# EasyEDA Pro project 医用手套驱动板.epro

# Board 医用手套驱动板
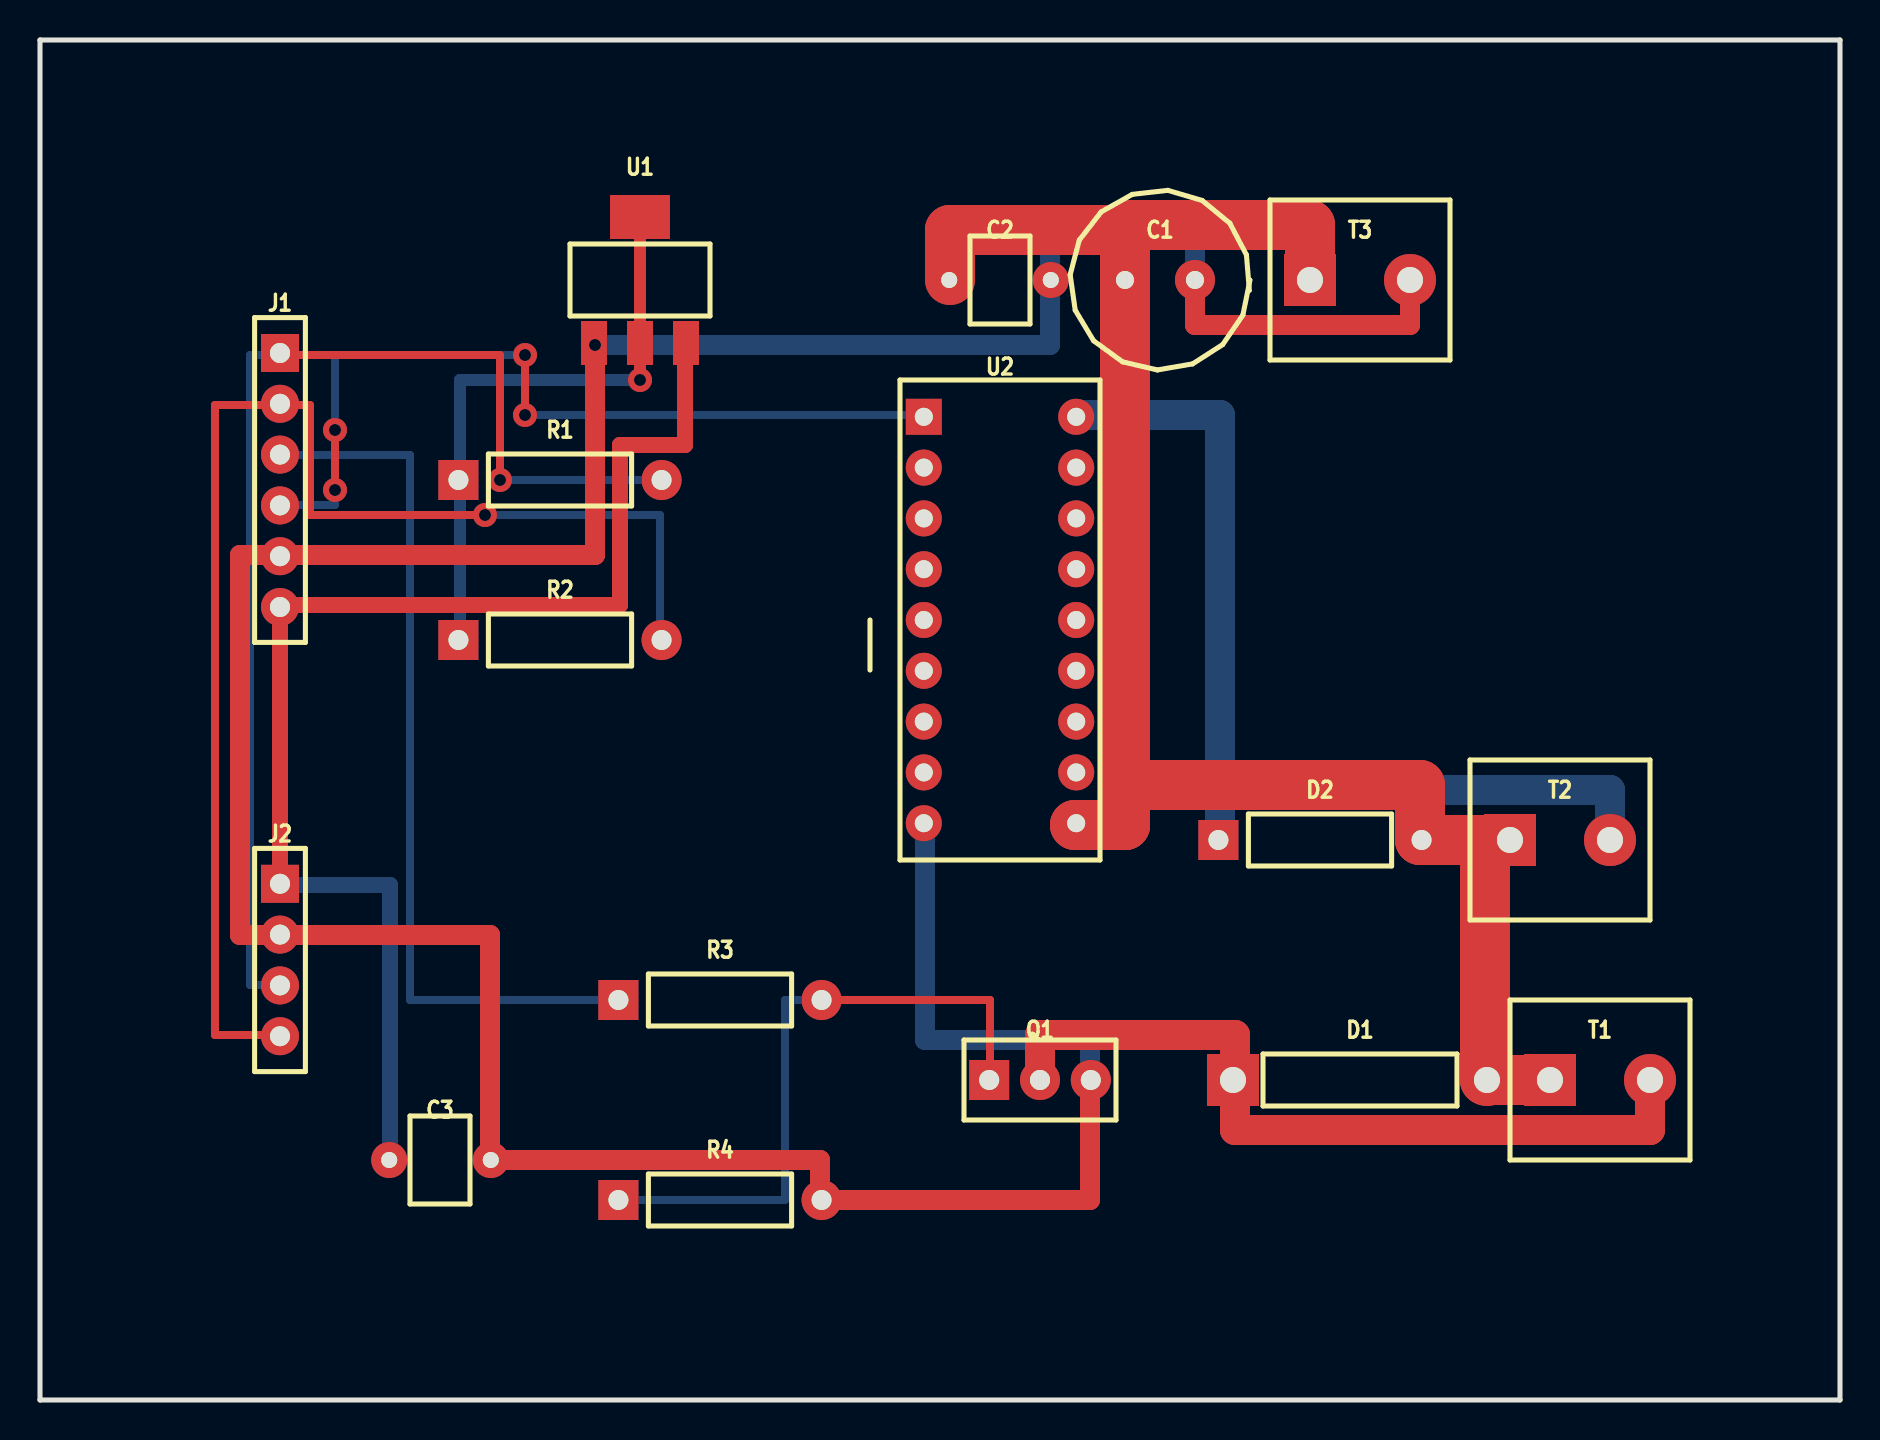
[diagram p0: board, top side]
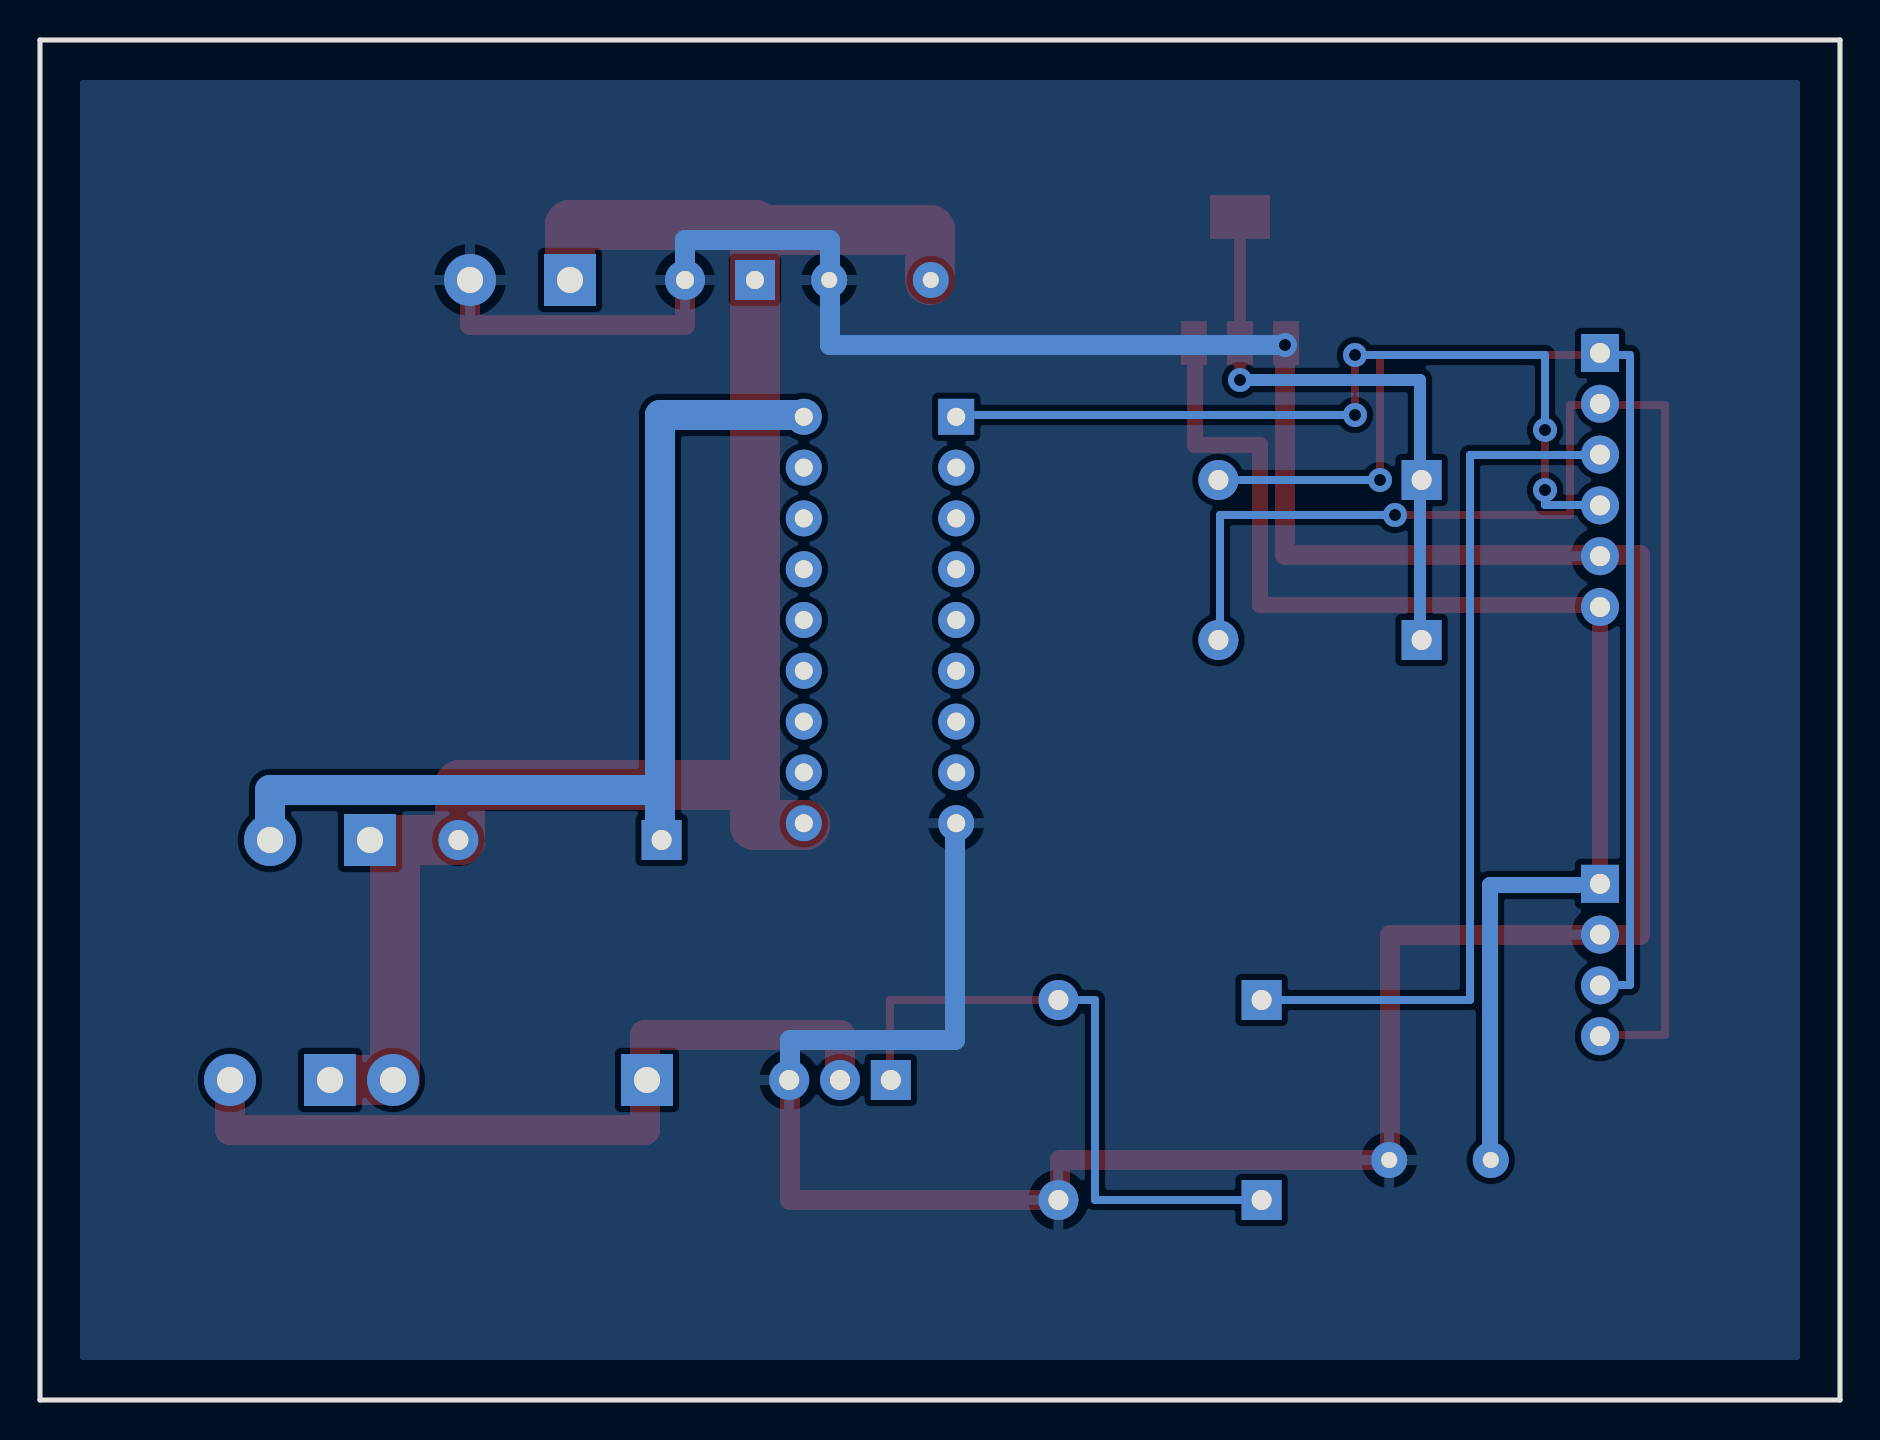
[diagram p1: board, bottom side, seen from below]

Outline 90 x 68 mm; copper layers: Top Layer, Bottom Layer. Coordinates in mm from the lower left corner of the outline.
Outline path: 0,68 90,68 90,0 0,0 0,68

## Placement (name value [footprint] x y rotation side)
C1  100uF  [ELEC]  56 56 0 top
C2  104  [CER]  48 56 0 top
C3  104  [CER]  20 12 0 top
D1  1N5822  [DO201AD]  66 16 0 top
D2  1N4007  [DO41]  64 28 0 top
J1  ATK到ZYNQ  [HDR6]  12 46 0 top
J2  气压传感器  [HDR4]  12 22 0 top
Q1  IRLZ44N  [TO220]  50 16 0 top
R1  4.7K  [AXIAL]  26 46 0 top
R2  4.7K  [AXIAL]  26 38 0 top
R3  100R  [AXIAL]  34 20 0 top
R4  100K  [AXIAL]  34 10 0 top
T1  气泵  [KF301]  78 16 0 top
T2  V2阀  [KF301]  76 28 0 top
T3  12V输入  [KF301]  66 56 0 top
U1  AMS1117-3.3  [SOT223]  30 56 0 top
U2  ULN2803APG  [DIP18]  48 39 0 top

## Footprints (pads in the part's own frame, mm; a bottom-side part is the same pattern mirrored in y, then rotated)
AXIAL
  rect 2x2 hole 1: 1(-5.08,0)
  round 2 hole 1: 2(5.08,0)
CER
  round 1.8 hole 0.8: 1(-2.54,0) 2(2.54,0)
DIP18
  rect 1.8x1.8 hole 0.9: 1(-3.81,10.16)
  round 1.8 hole 0.9: 2(-3.81,7.62) 3(-3.81,5.08) 4(-3.81,2.54) 5(-3.81,0) 6(-3.81,-2.54) 7(-3.81,-5.08) 8(-3.81,-7.62) 9(-3.81,-10.16) 10(3.81,-10.16) 11(3.81,-7.62) 12(3.81,-5.08) 13(3.81,-2.54) 14(3.81,0) 15(3.81,2.54) 16(3.81,5.08) 17(3.81,7.62) 18(3.81,10.16)
DO41
  rect 2x2 hole 1: 1(-5.08,0)
  round 2 hole 1: 2(5.08,0)
DO201AD
  rect 2.6x2.6 hole 1.3: 1(-6.35,0)
  round 2.6 hole 1.3: 2(6.35,0)
ELEC
  rect 2x2 hole 0.9: 1(-1.75,0)
  round 2 hole 0.9: 2(1.75,0)
HDR4
  rect 1.9x1.9 hole 1: 1(0,3.81)
  round 1.9 hole 1: 2(0,1.27) 3(0,-1.27) 4(0,-3.81)
HDR6
  rect 1.9x1.9 hole 1: 1(0,6.35)
  round 1.9 hole 1: 2(0,3.81) 3(0,1.27) 4(0,-1.27) 5(0,-3.81) 6(0,-6.35)
KF301
  rect 2.6x2.6 hole 1.3: 1(-2.5,0)
  round 2.6 hole 1.3: 2(2.5,0)
SOT223
  rect 1.3x2.2 smd: 1(-2.3,-3.15) 2(0,-3.15) 3(2.3,-3.15)
  rect 3x2.2 smd: 4(0,3.15)
TO220
  rect 2x2 hole 1: 1(-2.54,0)
  round 2 hole 1: 2(0,0) 3(2.54,0)

## Nets
+3.3V: R1.1 R2.1 U1.2 U1.4
+5V: C3.1 J1.6 J2.1 U1.3
+12V: C1.1 C2.1 D1.2 D2.2 T1.1 T2.1 T3.1 U2.10
GND: C1.2 C2.2 C3.2 J1.5 J2.2 Q1.3 R4.2 T3.2 U1.1 U2.9
GATE: Q1.1 R3.2 R4.1
PUMP: J1.3 R3.1
PUMP_D: D1.1 Q1.2 T1.2
SCL: J1.1 J2.3 R1.2
SDA: J1.2 J2.4 R2.2
VALVE: J1.4 U2.1
VALVE_OUT: D2.1 T2.2 U2.18

Pads without a net: U2 2 3 4 5 6 7 8 11 12 13 14 15 16 17

## Via types
v1: diameter 1.2, hole 0.6, Top Layer to Bottom Layer, 8 vias

## Routing (per net, layer and track width the routed paths; a pad name or vN(x,y) marks a point on that pad's centre or on a via; arc(x,y) is an arc through that point)
+3.3V: length 30.2
  Top Layer w0.6: 30,59.25 v1(30,51)
  Bottom Layer w0.6: 21,38 21,51 v1(30,51)
+5V: length 66.5
  Top Layer w0.8: 32.25,52.75 32.25,47.75 29,47.75 29,39.75 12,39.75 12,25.75
  Bottom Layer w0.8: 12,25.75 17.5,25.75 17.5,12
+12V: length 101.2
  Top Layer w2.5: 52.25,28.75 51.75,28.75 52.25,28.75 ; 52.25,28.75 52.75,28.75 ; 52.25,28.75 52.75,28.75 ; 53.25,28.75 52.75,28.75 ; 53.25,28.75 53.75,28.75 ; 53.25,28.75 53.75,28.75 ; 53.25,28.75 52.75,28.75 ; T3.1 63.5,58.75 54.25,58.75 C1.1 ; 53.75,28.75 54.25,28.75 ; 53.75,28.75 54.25,28.75 ; 54.25,28.75 54.25,30.75 69,30.75 69,28 T2.1 72.25,28 72.25,16 T1.1 ; 54.25,28.75 C1.1 ; 45.5,56 45.5,58.5 54.25,58.5 C1.1
GND: length 182.5
  Top Layer w1: C1.2 57.75,53.75 68.5,53.75 T3.2 ; v1(27.75,52.75) 27.75,42.25 10,42.25 10,23.25 22.5,23.25 22.5,12 39,12 39,10 52.5,10 52.5,16
  Bottom Layer w1: v1(27.75,52.75) 50.5,52.75 50.5,58 57.75,58 C1.2 ; 44.25,28.75 44.25,18 52.5,18 52.5,16
GATE: length 32.5
  Top Layer w0.4: 39,20 47.5,20 47.5,16
  Bottom Layer w0.4: 29,10 37.25,10 37.25,20 39,20
PUMP: length 44.2
  Bottom Layer w0.4: 29,20 18.5,20 18.5,47.25 12,47.25
PUMP_D: length 40
  Top Layer w1.5: T1.2 80.5,13.5 59.75,13.5 59.75,18.25 50,18.25 Q1.2
SCL: length 59.8
  Top Layer w0.4: 12,52.25 23,52.25 v1(23,46)
  Bottom Layer w0.4: v1(23,46) 31,46 ; 12,52.25 10.5,52.25 10.5,20.75 12,20.75
SDA: length 68.8
  Top Layer w0.4: v1(22.25,44.25) 13.5,44.25 13.5,49.75 8.75,49.75 8.75,18.25 12,18.25
  Bottom Layer w0.4: 31,38 31,44.25 v1(22.25,44.25)
VALVE: length 42.8
  Top Layer w0.4: v1(14.75,45.5) v1(14.75,48.5) ; v1(24.25,52.25) v1(24.25,49.25)
  Bottom Layer w0.4: v1(14.75,45.5) 14.75,44.75 12,44.75 ; v1(24.25,52.25) 14.75,52.25 v1(14.75,48.5) ; v1(24.25,49.25) 44.25,49.25
VALVE_OUT: length 53
  Bottom Layer w1.5: 51.75,49.25 59,49.25 59,30.5 ; 59,30.5 59,30 ; 59,30.5 78.5,30.5 T2.2 ; 59,30.5 59,30 ; 59,30 59,29.5 ; 59,30 59,29.5 ; 59,28.5 59,28 59,28.5 ; 59,28.5 59,29 ; 59,28.5 59,29 ; 59,29 59,29.5 ; 59,29 59,29.5

## Copper pours and planes (outline as drawn; the poured copper is in the pictures)
GND on Bottom Layer: 2,66 88,66 88,2 2,2

## Text on the board
Top Silkscreen Layer: J1 | J2 | C3 | R1 | R2 | U1 | R3 | R4 | C2 | U2 | Q1 | C1 | D2 | T3 | D1 | T2 | T1
